# EAGLE schematic mini_board0 (EAGLE 6.5.0)
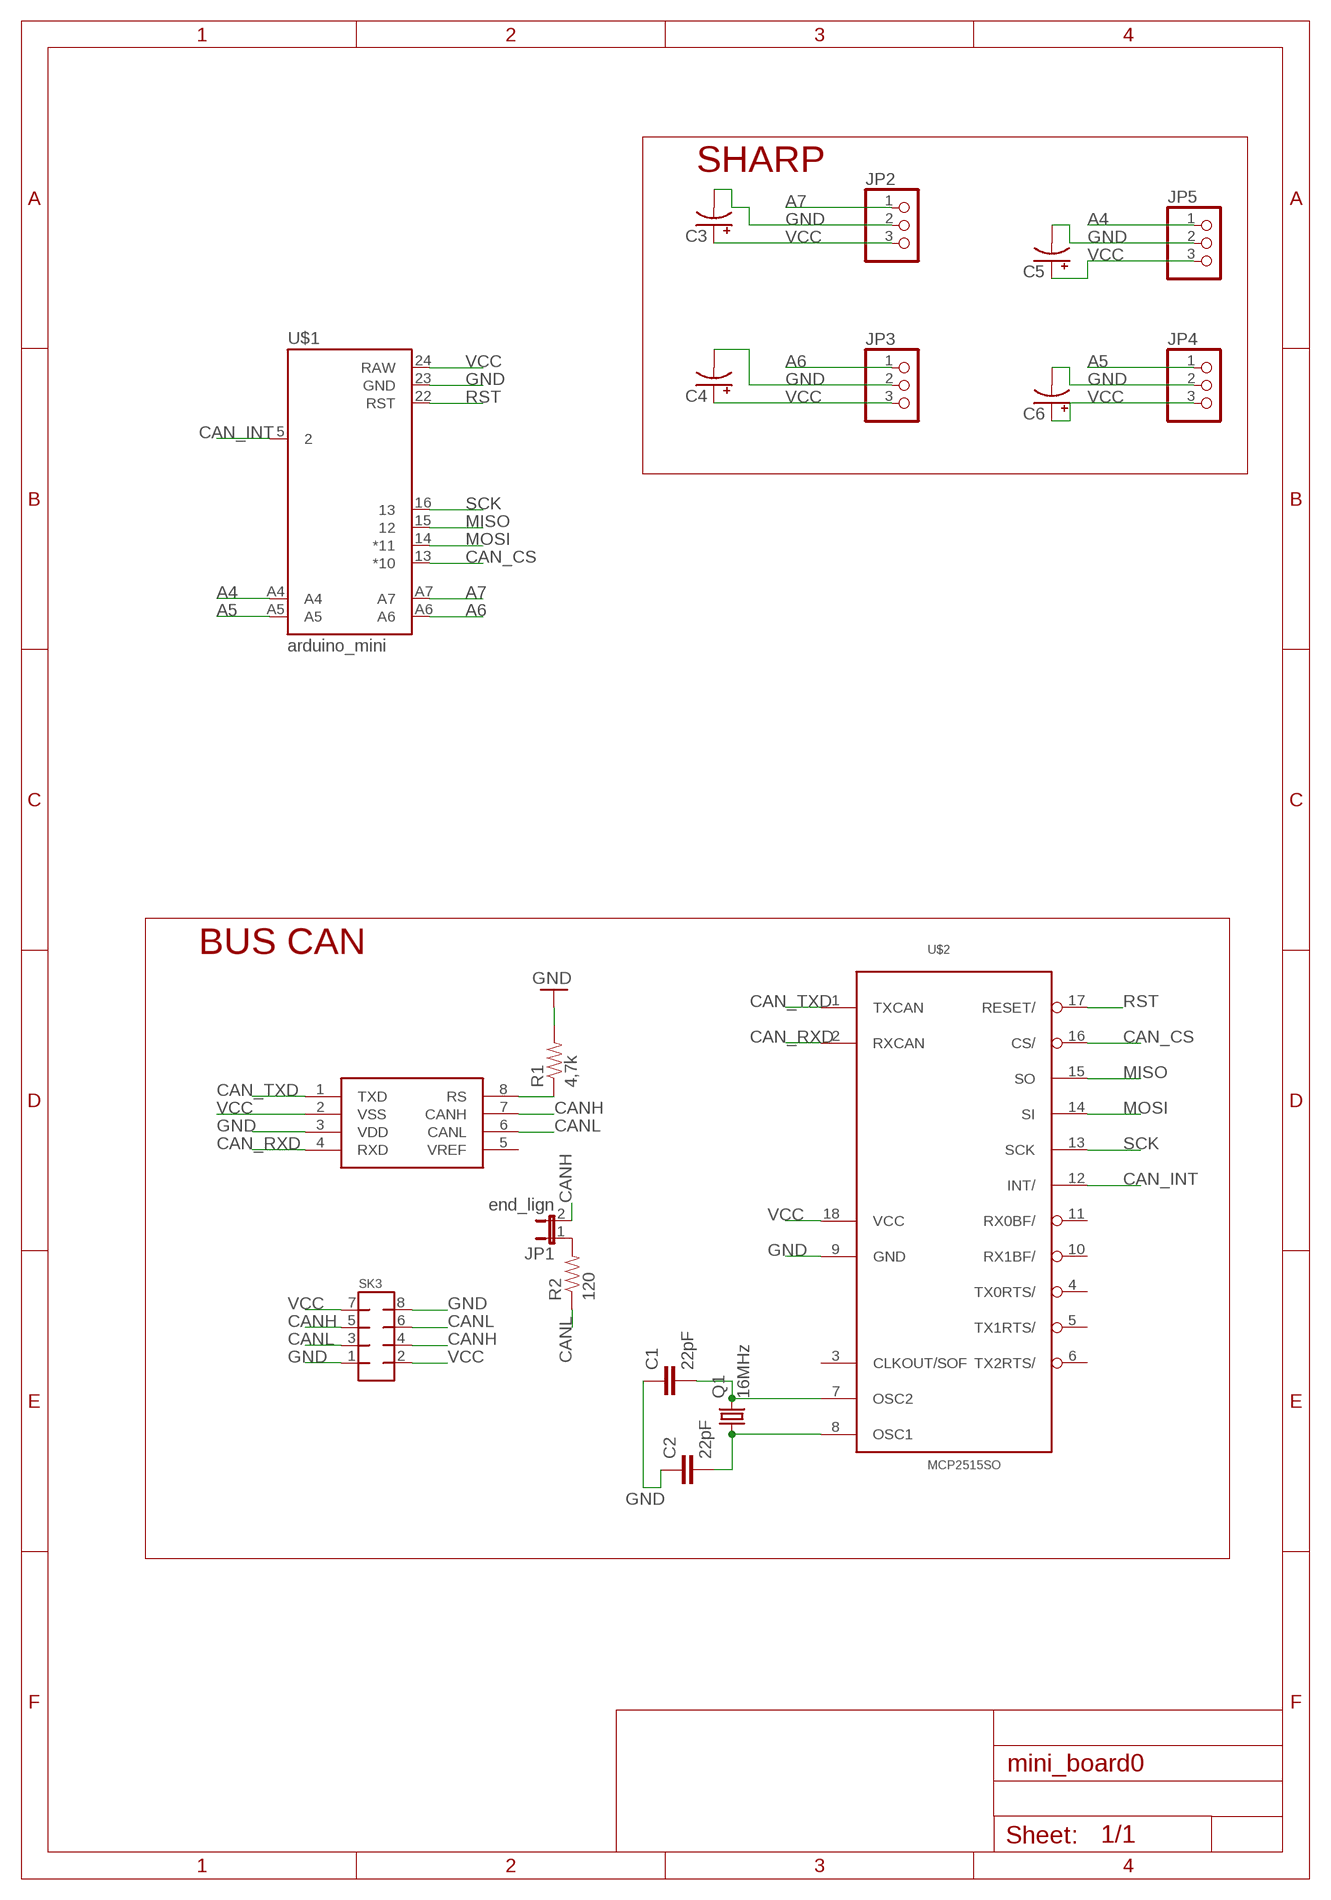
[diagram p0: schematic, sheet 1]

## Parts
C1  22pF  CAP0805  [0805]
C2  22pF  CAP0805  [0805]
C3  CAP_POLPTH2  [CPOL-RADIAL-10UF-25V]
C4  CAP_POLPTH2  [CPOL-RADIAL-10UF-25V]
C5  CAP_POLPTH2  [CPOL-RADIAL-10UF-25V]
C6  CAP_POLPTH2  [CPOL-RADIAL-10UF-25V]
JP1  end_lign  JUMPER-2PTH  [1X02]
JP2  PINHD-1X3/90  [1X03/90]
JP3  PINHD-1X3/90  [1X03/90]
JP4  PINHD-1X3/90  [1X03/90]
JP5  PINHD-1X3/90  [1X03/90]
Q1  16MHz  CRYSTALHC49S  [HC49/S]
R1  4,7k  RESISTOR0805-RES  [0805]
R2  120  RESISTOR0805-RES  [0805]
SK3  MMATCH-8-SMT  [AMP-188275-8]
U1  MCP2551  [SO08]
U$1  arduino_mini  ARDUINO_PRO_MINISHARP_CAPE  [ARDUINO_PRO_MINI]
U$2  MCP2515SO  [SO18L]

## Nets
A4: JP5.1 U$1.A4
A5: JP4.1 U$1.A5
A6: JP3.1 U$1.A6
A7: JP2.1 U$1.A7
CAN_CS: U$1.13(*10) U$2.16(CS/)
CAN_INT: U$1.5 U$2.12(INT/)
CAN_RXD: U1.4(RXD) U$2.2(RXCAN)
CAN_TXD: U1.1(TXD) U$2.1(TXCAN)
CANH: JP1.2 SK3.4 SK3.5 U1.7(CANH)
CANL: R2.1 SK3.3 SK3.6 U1.6(CANL)
GND: C1.1 C2.1 C3.2(-) C4.2(-) C5.2(-) C6.2(-) JP2.2 JP3.2 JP4.2 JP5.2 R1.2 SK3.1 SK3.8 U1.3(VDD) U$1.23(GND) U$2.9(GND)
MISO: U$1.15 U$2.15(SO)
MOSI: U$1.14(*11) U$2.14(SI)
N$2: C1.2 Q1.2 U$2.7(OSC2)
N$3: C2.2 Q1.1 U$2.8(OSC1)
N$5: R1.1 U1.8(RS)
N$7: JP1.1 R2.2
RST: U$1.22(RST) U$2.17(RESET/)
SCK: U$1.16 U$2.13(SCK)
VCC: C3.1(+) C4.1(+) C5.1(+) C6.1(+) JP2.3 JP3.3 JP4.3 JP5.3 SK3.2 SK3.7 U1.2(VSS) U$1.24(RAW) U$2.18(VCC)
Unconnected: U1.5(VREF) U$2.3(CLKOUT/SOF) U$2.4(TX0RTS/) U$2.5(TX1RTS/) U$2.6(TX2RTS/) U$2.10(RX1BF/) U$2.11(RX0BF/)

## Notes on the sheet
- SHARP
- BUS CAN

## Library data of the parts
C1 C2 = SparkFun-Capacitors:CAP: Capacitor Standard 0603 ceramic capacitor, and 0.1" leaded capacitor.
C3-C6 = SparkFun-Capacitors:CAP_POL: Capacitor Polarized These are standard SMD and PTH capacitors. Normally 10uF, 47uF, and 100uF in electrolytic and tantalum varieties. Always verify the external diameter of the through hole cap, it varies with capacity, voltage, and manufacturer. The EIA devices should be standard.
JP1 = SparkFun-Passives:JUMPER-2: Jumper Basic 0.1" spaced jumper. Use with breakaway headers.
JP2-JP5 = pinhead:PINHD-1X3: PIN HEADER
Q1 = adafruit:CRYSTAL: CRYSTAL; OC_FARNELL: 1667008; OC_NEWARK: unknown
R1 R2 = SparkFun-Passives:RESISTOR: Resistor Basic schematic elements and footprints for 0603, 1206, and PTH resistors.
SK3 = jt-con-micromatch:MMATCH-8-*: AMP Micromatch 8-pin
U1 = SparkFun-DigitalIC:MCP2551: CAN transceiver
U$1 = custom_can_bus:ARDUINO_PRO_MINI
U$2 = MCP2515_MT:MCP2515*: MCP2515 Standalone CAN-Controller by Microchip Eagle-Lib. by MartinThomas

## Net classes
0 default: clearance 0.205 mm